# EAGLE schematic Select Fire Rapidstrike (EAGLE 9.4.2)

## Sheet 1 of 3
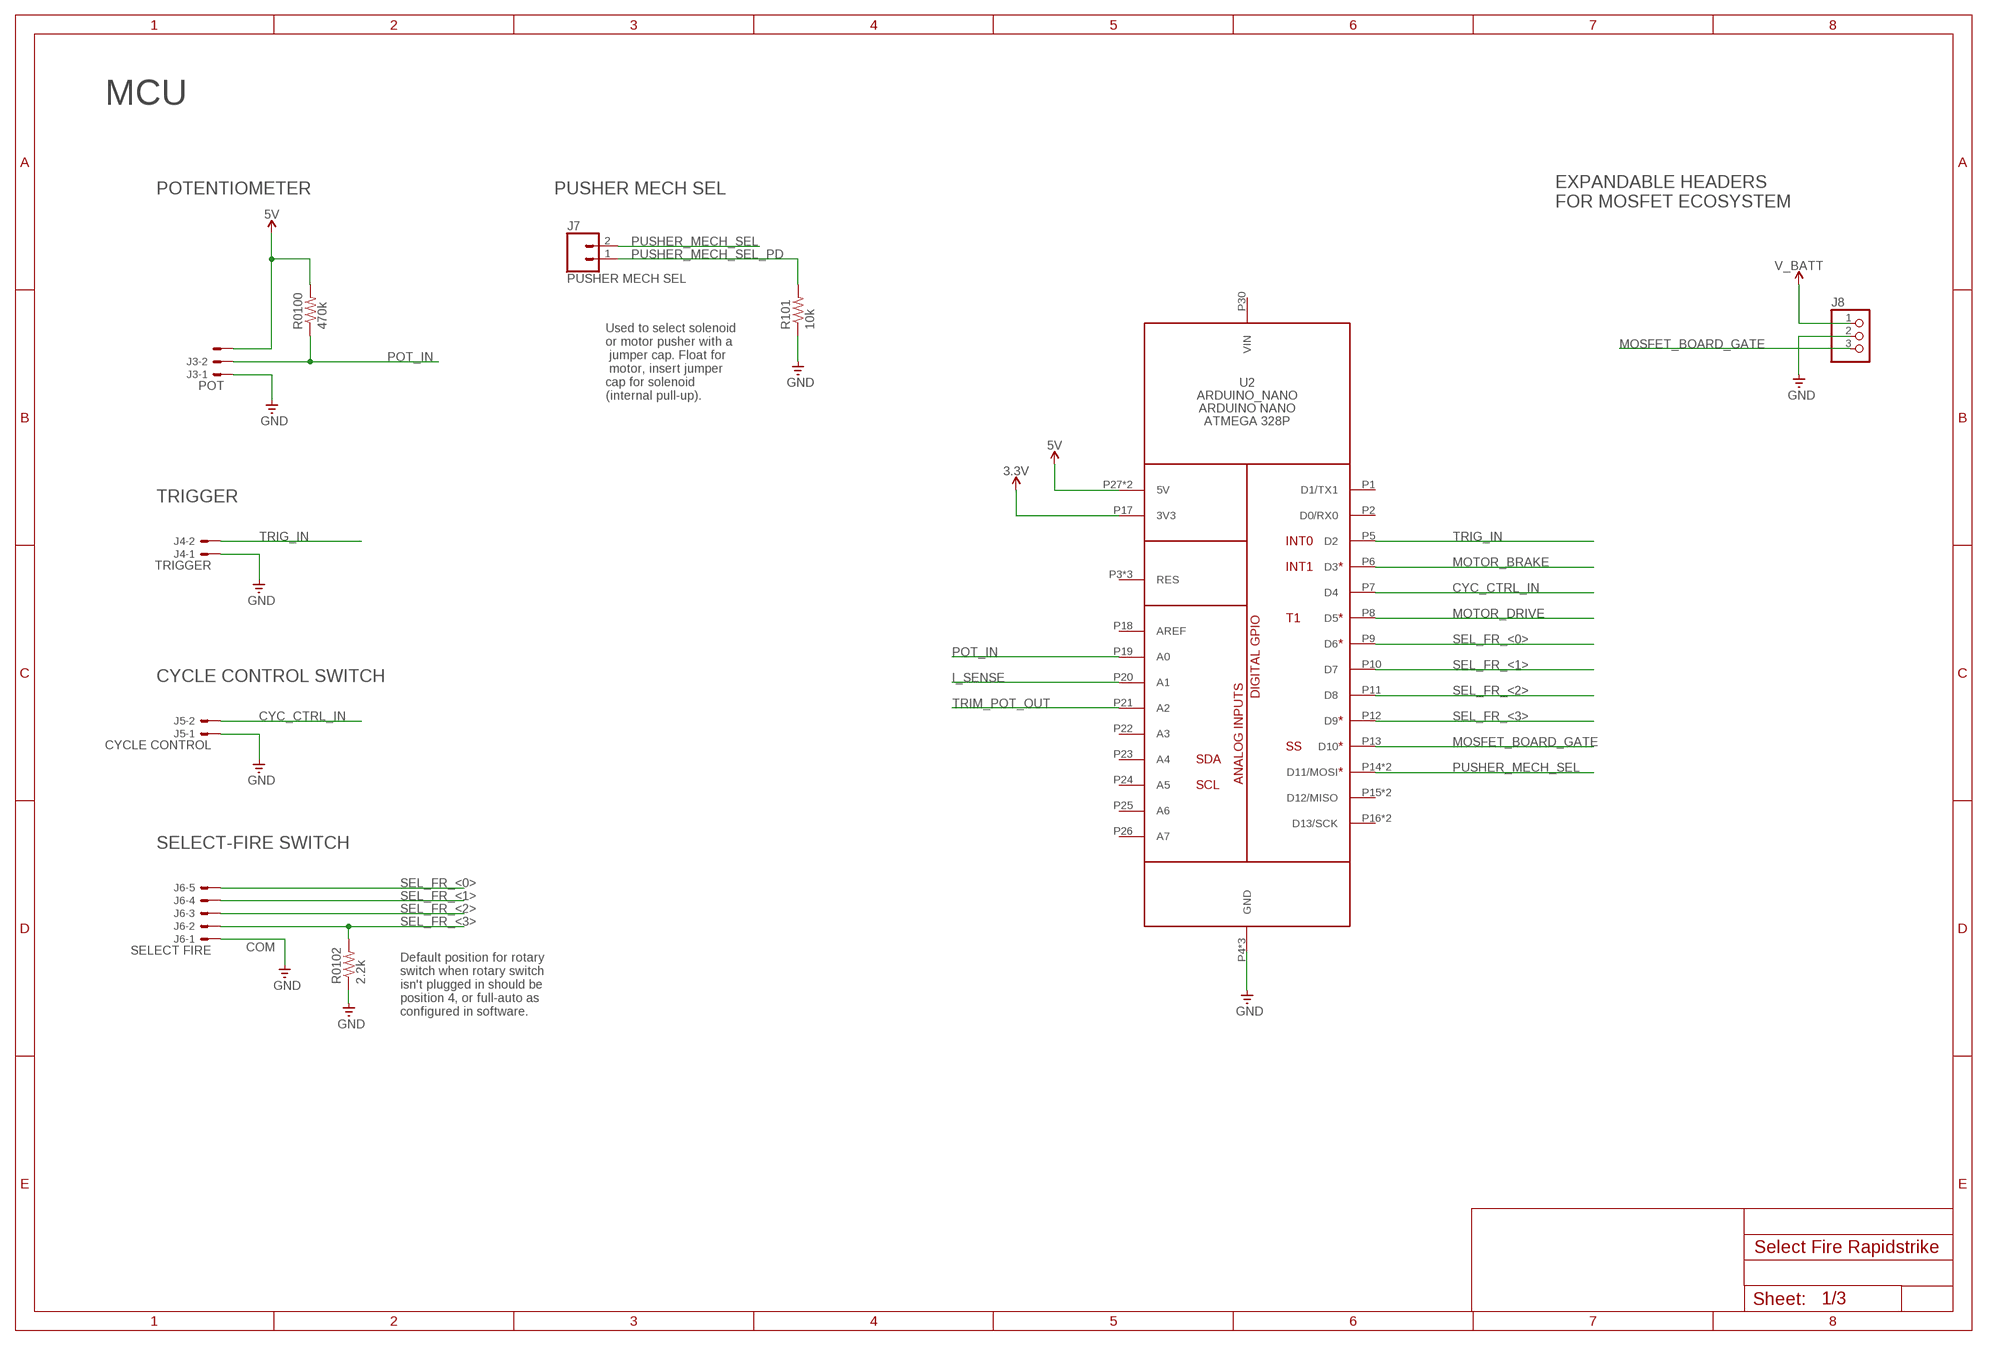
[diagram p0: schematic, sheet 1]

### Parts
J3  POT  JST-XH-03-PIN-LONG-PAD  [JST-XH-03-PACKAGE-LONG-PAD]
J4  TRIGGER  JST-XH-02-PIN-LONG-PAD  [JST-XH-02-PACKAGE-LONG-PAD]
J5  CYCLE CONTROL  JST-XH-02-PIN-LONG-PAD  [JST-XH-02-PACKAGE-LONG-PAD]
J6  SELECT FIRE  JST-XH-05-PIN-LONG-PAD  [JST-XH-05-PACKAGE-LONG-PAD]
J7  PUSHER MECH SEL  CONN_02  [1X02]
J8  PINHD-1X3  [1X03]
R0100  470k  R-US_M0805  [M0805]
R101  10k  R-US_M0805  [M0805]
R0102  2.2k  R-US_M0805  [M0805]
U2  ARDUINO_NANO  [ARDUINO_NANO]

### Nets
3.3V: U2.P17(3V3) ; also sheet 2
5V: J3.3 R0100.2 U2.P27(5V) U2.P36(5V) ; also sheet 2,3
CYC_CTRL_IN: J5.2 U2.P7(D4)
GND: J3.1 J4.1 J5.1 J6.1 J8.2 R101.1 R0102.1 U2.P4(GND) U2.P29(GND) U2.P32(GND) ; also sheet 2,3
I_SENSE: U2.P20(A1) ; also sheet 3
MOSFET_BOARD_GATE: J8.3 U2.P13(D10)
MOTOR_BRAKE: U2.P6(D3) ; also sheet 3
MOTOR_DRIVE: U2.P8(D5) ; also sheet 3
POT_IN: J3.2 R0100.1 U2.P19(A0)
PUSHER_MECH_SEL: J7.2 U2.P14(D11/MOSI) U2.P34(D11/MOSI)
PUSHER_MECH_SEL_PD: J7.1 R101.2
SEL_FR_<0>: J6.5 U2.P9(D6)
SEL_FR_<1>: J6.4 U2.P10(D7)
SEL_FR_<2>: J6.3 U2.P11(D8)
SEL_FR_<3>: J6.2 R0102.2 U2.P12(D9)
TRIG_IN: J4.2 U2.P5(D2)
TRIM_POT_OUT: U2.P21(A2)
V_BATT_RAW: J8.1 ; supply symbol labelled V_BATT ; also sheet 2,3
Unconnected: U2.P1(D1/TX1) U2.P2(D0/RX0) U2.P3(RES) U2.P15(D12/MISO) U2.P16(D13/SCK) U2.P18(AREF) U2.P22(A3) U2.P23(A4) U2.P24(A5) U2.P25(A6) U2.P26(A7) U2.P28(RES) U2.P30(VIN) U2.P31(RES) U2.P33(D13/SCK) U2.P35(D12/MISO)

### Notes on the sheet
- MCU
- POTENTIOMETER | PUSHER MECH SEL
- EXPANDABLE HEADERS 
  FOR MOSFET ECOSYSTEM
- Used to select solenoid 
  or motor pusher with a
   jumper cap. Float for
   motor, insert jumper 
  cap for solenoid 
  (internal pull-up).
- TRIGGER
- CYCLE CONTROL SWITCH
- SELECT-FIRE SWITCH
- COM
- Default position for rotary
  switch when rotary switch 
  isn't plugged in should be 
  position 4, or full-auto as 
  configured in software.

## Sheet 2 of 3
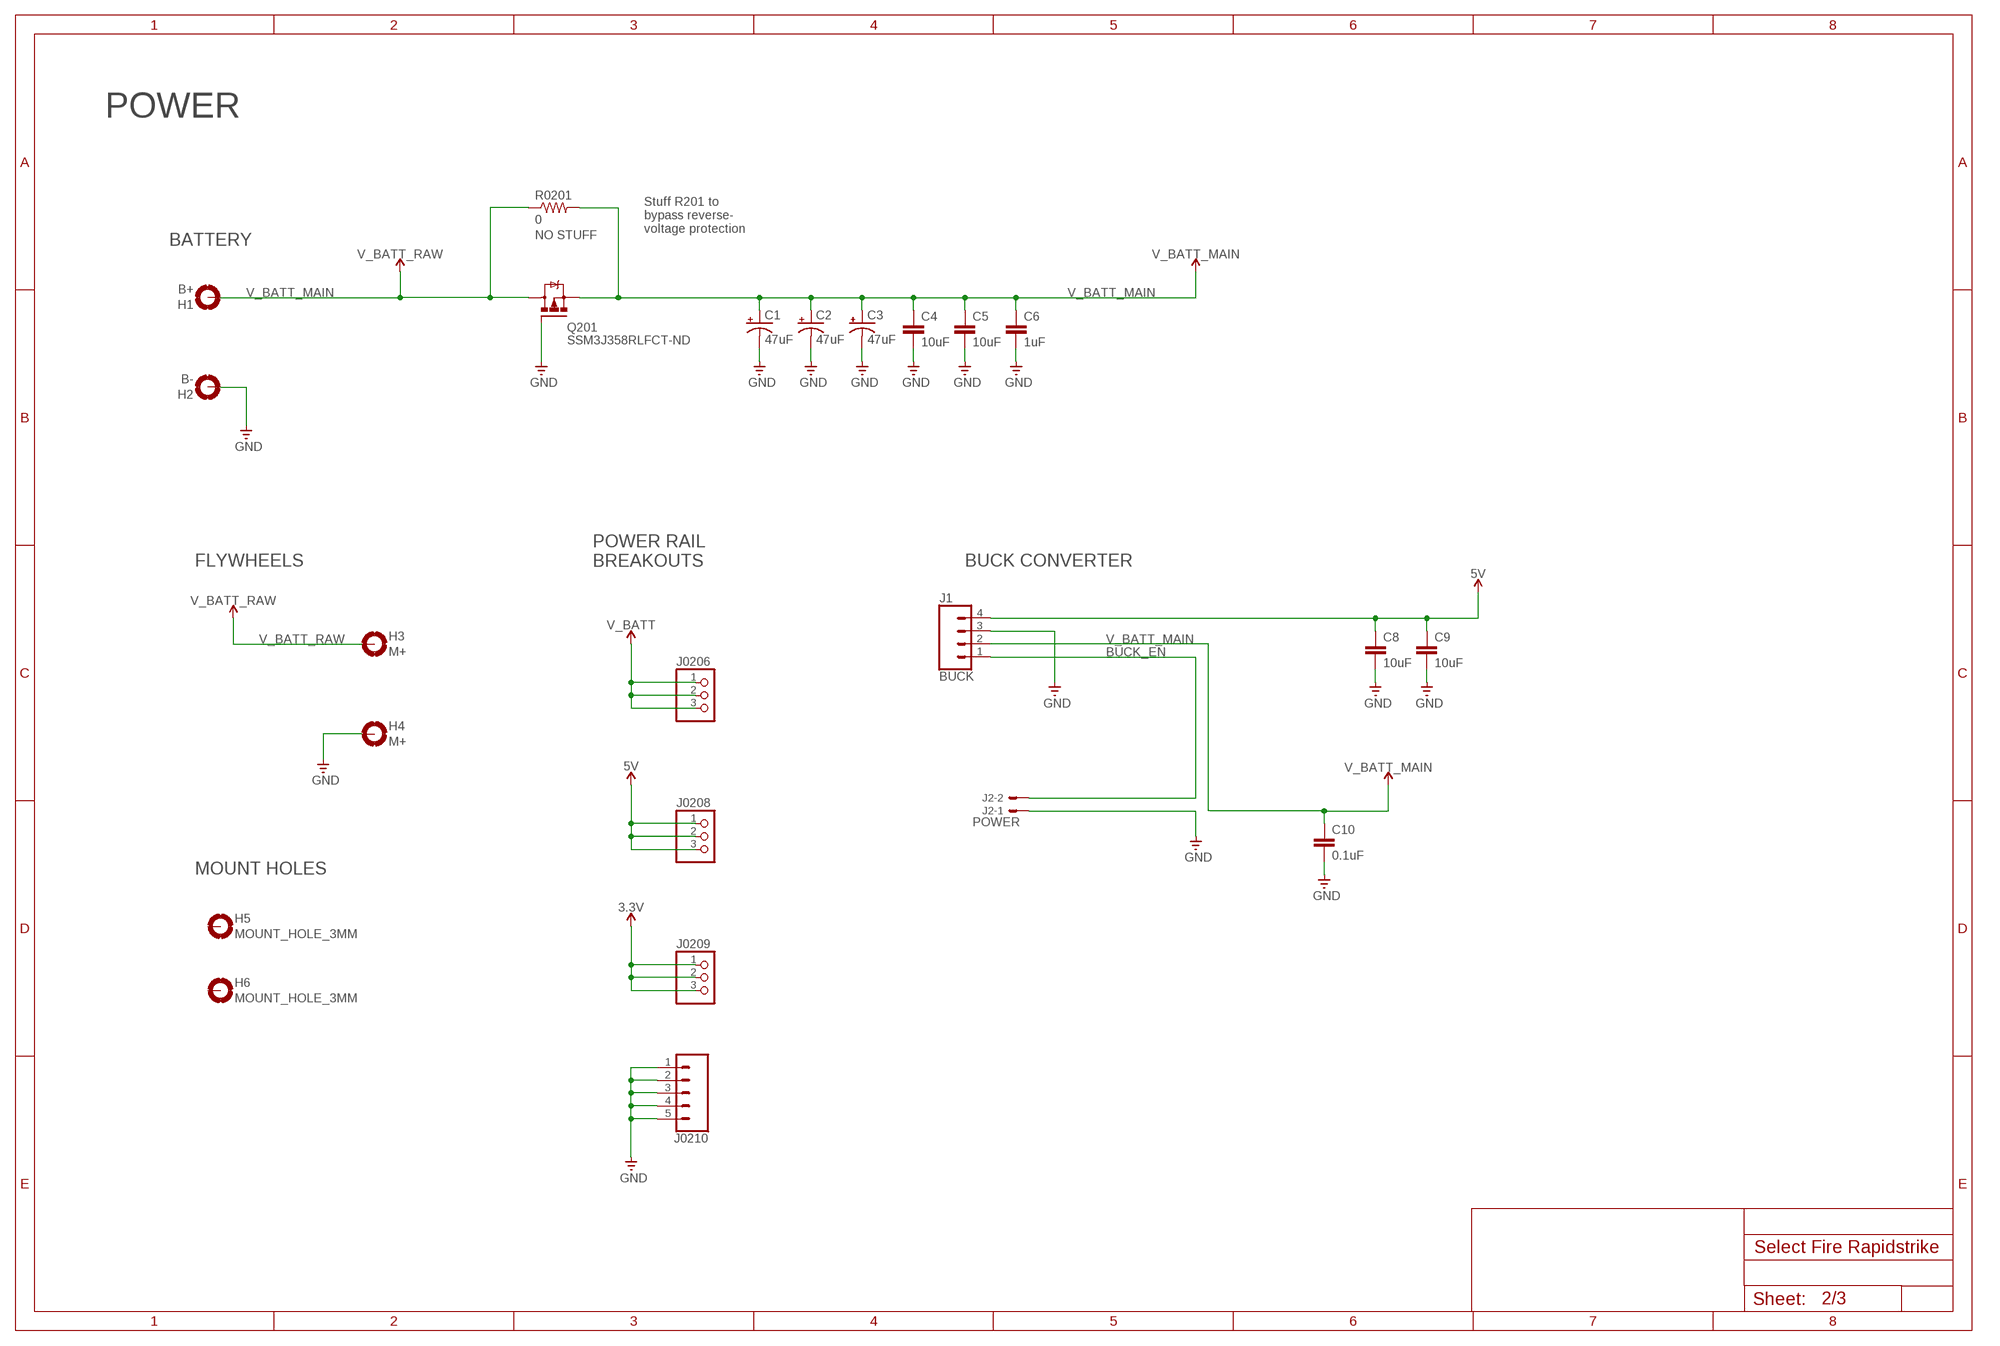
[diagram p1: schematic, sheet 2]

### Parts
C1  47uF  CPOL-USE2-5  [E2-5]
C2  47uF  CPOL-USE2-5  [E2-5]
C3  47uF  CPOL-USE2-5  [E2-5]
C4  10uF  CC1206  [C1206]
C5  10uF  CC1206  [C1206]
C6  1uF  C-EUC0805  [C0805]
C8  10uF  CC1206  [C1206]
C9  10uF  CC1206  [C1206]
C10  0.1uF  C-EUC0805  [C0805]
H1  B+  MOUNT-HOLE-2.5MM  [MOUNT-HOLE-2.5MM]
H2  B-  MOUNT-HOLE-2.5MM  [MOUNT-HOLE-2.5MM]
H3  M+  MOUNT-HOLE-2.5MM  [MOUNT-HOLE-2.5MM]
H4  M+  MOUNT-HOLE-2.5MM  [MOUNT-HOLE-2.5MM]
H5  MOUNT_HOLE_3MM  [MOUNT_HOLE_3MM]
H6  MOUNT_HOLE_3MM  [MOUNT_HOLE_3MM]
J1  BUCK  CONN_04  [1X04]
J2  POWER  JST-XH-02-PIN-LONG-PAD  [JST-XH-02-PACKAGE-LONG-PAD]
J0206  PINHD-1X3  [1X03]
J0208  PINHD-1X3  [1X03]
J0209  PINHD-1X3  [1X03]
J0210  CONN_05  [1X05]
Q201  SSM3J358RLFCT-ND  MOSFET-P-SOT23  [SOT-23]
R0201  0  R-US_R1206  [R1206]

### Nets
3.3V: J0209.1 J0209.2 J0209.3 ; also sheet 1
5V: C8.1 C9.1 J1.4 J0208.1 J0208.2 J0208.3 ; also sheet 1,3
BUCK_EN: J1.1 J2.2
GND: C1.- C2.- C3.- C4.2 C5.2 C6.2 C8.2 C9.2 C10.2 H2.P$1(MOUNT) H4.P$1(MOUNT) J1.3 J2.1 J0210.1 J0210.2 J0210.3 J0210.4 J0210.5 Q201.1(G) ; also sheet 1,3
V_BATT_MAIN: C1.+ C2.+ C3.+ C4.1 C5.1 C6.1 C10.1 J1.2 Q201.2(S) R0201.2 ; supply symbol labelled V_BATT
V_BATT_RAW: H1.P$1(MOUNT) H3.P$1(MOUNT) J0206.1 J0206.2 J0206.3 Q201.3(D) R0201.1 ; supply symbol labelled V_BATT ; also sheet 1,3
Unconnected: H5.P$1(MOUNT) H6.P$1(MOUNT)

### Notes on the sheet
- POWER
- Stuff R201 to 
  bypass reverse-
  voltage protection
- BATTERY
- FLYWHEELS
- POWER RAIL
  BREAKOUTS
- BUCK CONVERTER
- MOUNT HOLES

## Sheet 3 of 3
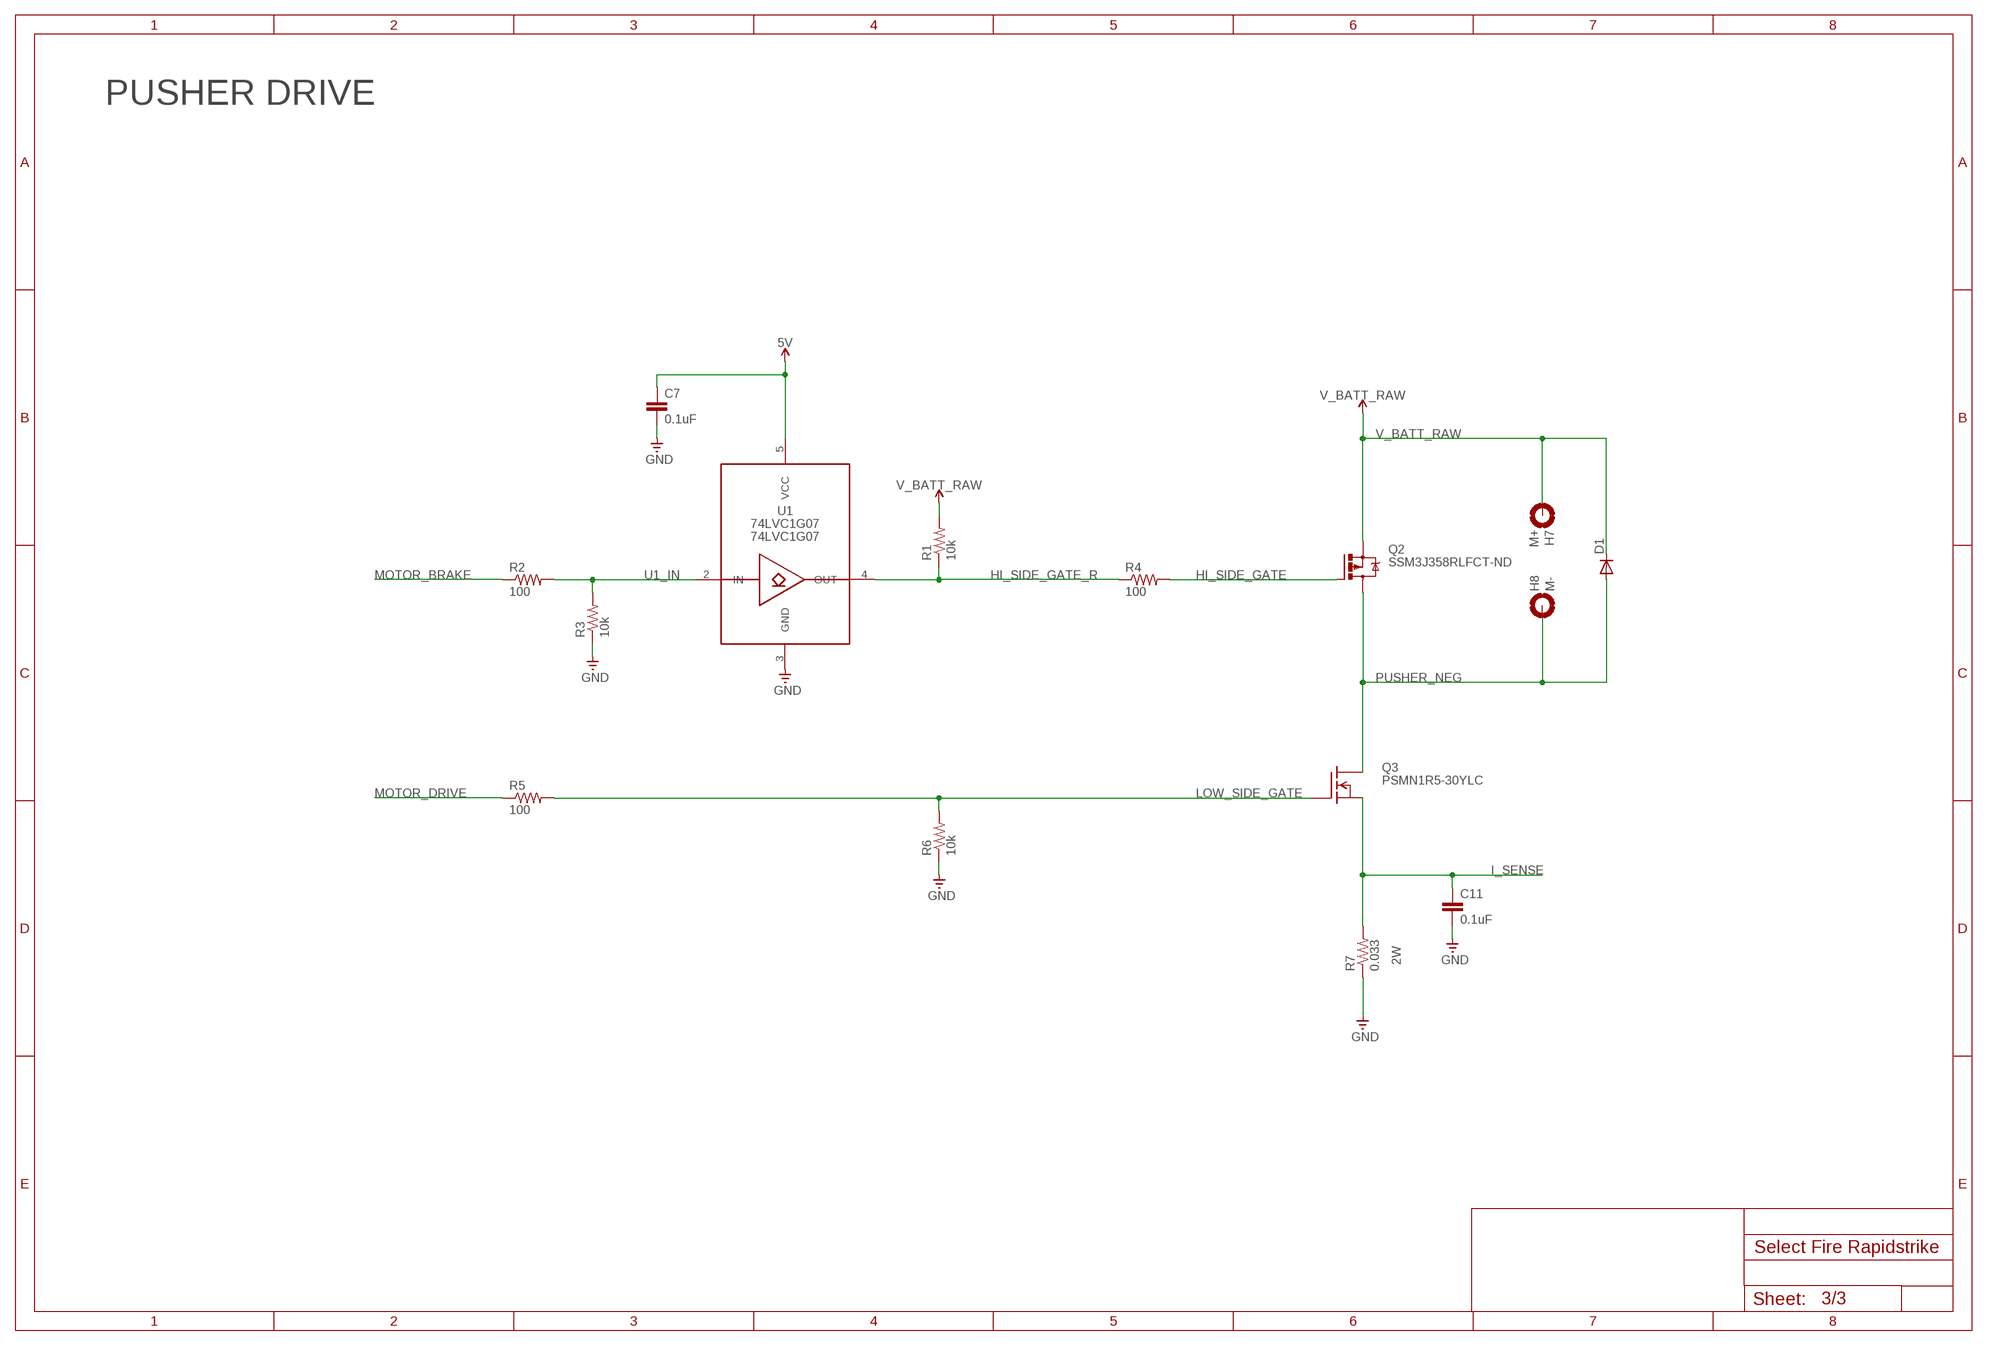
[diagram p2: schematic, sheet 3]

### Parts
C7  0.1uF  C-EUC0805  [C0805]
C11  0.1uF  C-EUC0805  [C0805]
D1  S2A  [DO214AA]
H7  M+  MOUNT-HOLE-2.5MM  [MOUNT-HOLE-2.5MM]
H8  M-  MOUNT-HOLE-2.5MM  [MOUNT-HOLE-2.5MM]
Q2  SSM3J358RLFCT-ND  MOSFET-P-SOT23  [SOT-23]
Q3  PSMN1R5-30YLC  [TO127P600X120-5N]
R1  10k  R-US_M0805  [M0805]
R2  100  R-US_M0805  [M0805]
R3  10k  R-US_M0805  [M0805]
R4  100  R-US_M0805  [M0805]
R5  100  R-US_M0805  [M0805]
R6  10k  R-US_M0805  [M0805]
R7  0.033  R-US_R2512  [R2512]
U1  74LVC1G07  [SOT23-5]

### Nets
5V: C7.1 U1.5(VCC) ; also sheet 1,2
GND: C7.2 C11.2 R3.1 R6.1 R7.1 U1.3(GND) ; also sheet 1,2
HI_SIDE_GATE: Q2.1(G) R4.2
HI_SIDE_GATE_R: R1.1 R4.1 U1.4(OUT)
I_SENSE: C11.1 Q3.1(S) Q3.2(S) Q3.3(S) R7.2 ; also sheet 1
LOW_SIDE_GATE: Q3.4(G) R5.2 R6.2
MOTOR_BRAKE: R2.1 ; also sheet 1
MOTOR_DRIVE: R5.1 ; also sheet 1
PUSHER_NEG: D1.A H8.P$1(MOUNT) Q2.3(D) Q3.5(D)
U1_IN: R2.2 R3.2 U1.2(IN)
V_BATT_RAW: D1.C H7.P$1(MOUNT) Q2.2(S) R1.2 ; supply symbol labelled V_BATT ; also sheet 1,2

### Notes on the sheet
- PUSHER DRIVE

## Library data of the parts
C1-C3 = adafruit:CPOL-US: POLARIZED CAPACITOR, American symbol
C4 C5 C8 C9 = eagle-ltspice:C: CAPACITOR, European symbol; SPICEMODEL: NONE; SPICEPREFIX: C
C6 C7 C10 C11 = rcl:C-EU: CAPACITOR, European symbol; SPICEPREFIX: C
D1 = s2x_10:S2*: S2A - S2M General Purpose Rectifiers Source: http://www.fairchildsemi.com/datasheets/S2/S2A.pdf; MF: Fairchild; MPN: S2A; OC_FARNELL: 1467485; OC_NEWARK: 58K2391
H1-H4 H7 H8 = my-eagle-lib:MOUNT-HOLE-2.5MM: Mount hole, 2.5mm inner diameter. Fits 14awg wiring great, 16awg a bit tight. Used in MOSFET board kit v1.2.
H5 H6 = my-eagle-lib:MOUNT_HOLE_3MM: Mount hole with 3mm inner diameter. Should be good for Nerf screws, will test that in Select-fire Rapidstrik p0.1 board MLB.
J1 = SparkFun-Connectors:CONN_04: Multi connection point. Often used as Generic Header-pin footprint for 0.1 inch spaced/style header connections On any of the 0.1 inch spaced packages, you can populate with these: Break Away Headers - Straight <https://www.sparkfun.com/products/116> (PRT-00116) Break Away Male Headers - Right Angle <https://www.sparkfun.com/products/553> (PRT-00553) Female Headers <https://www.sparkfun.com/products/115> (PRT-00115) Break Away Headers - Machine Pin <https://www.sparkfun.com/products/117> (PRT-00117) Break Away Female Headers - Swiss Machine Pin <https://www.sparkfun.com/products/743> (PRT-00743) For SCREWTERMINALS and SPRING TERMINALS visit here: Screw Terimnals on SparkFun.com <https://www.sparkfun.com/search/results?term=Screw+Terminals> (5mm/3.5mm/2.54mm spacing) This device is also useful as a general connection point to wire up your design to another part of your project. Our various solder wires solder well into these plated through hole pads. Hook-Up Wire - Assortment (Stranded, 22 AWG) <https://www.sparkfun.com/products/11375> (PRT-11375) Hook-Up Wire - Assortment (Solid Core, 22 AWG) <https://www.sparkfun.com/products/11367> (PRT-11367) View the entire wire category on our website here <https://www.sparkfun.com/categories/141> Special notes: Molex polarized connector foot print use with SKU : PRT-08231 with associated crimp pins and housings. 1MM SMD Version SKU: PRT-10208; PROD_ID: CONN-09696
J2 J4 J5 = Rembrandt Electronics - JST XH Connectors v1-0:JST-XH-02-PIN: JST XH Connector 2 Pin Wire to board connector. Pitch: 2,54 mm, (0.100") Number of pins: 2 Created by Rembrandt Electronics www.rembrandtelectronics.com
J3 = Rembrandt Electronics - JST XH Connectors v1-0:JST-XH-03-PIN: JST XH Connector 2 Pin Wire to board connector. Pitch: 2,54 mm, (0.100") Number of pins: 3 Created by Rembrandt Electronics www.rembrandtelectronics.com
J6 = Rembrandt Electronics - JST XH Connectors v1-0:JST-XH-05-PIN: JST XH Connector 2 Pin Wire to board connector. Pitch: 2,54 mm, (0.100") Number of pins: 5 Created by Rembrandt Electronics www.rembrandtelectronics.com
J7 = SparkFun-Connectors:CONN_02: Multi connection point. Often used as Generic Header-pin footprint for 0.1 inch spaced/style header connections On any of the 0.1 inch spaced packages, you can populate with these: Break Away Headers - Straight <https://www.sparkfun.com/products/116> (PRT-00116) Break Away Male Headers - Right Angle <https://www.sparkfun.com/products/553> (PRT-00553) Female Headers <https://www.sparkfun.com/products/115> (PRT-00115) Break Away Headers - Machine Pin <https://www.sparkfun.com/products/117> (PRT-00117) Break Away Female Headers - Swiss Machine Pin <https://www.sparkfun.com/products/743> (PRT-00743) For SCREWTERMINALS and SPRING TERMINALS visit here: Screw Terimnals on SparkFun.com <https://www.sparkfun.com/search/results?term=Screw+Terminals> (5mm/3.5mm/2.54mm spacing) This device is also useful as a general connection point to wire up your design to another part of your project. Our various solder wires solder well into these plated through hole pads. Hook-Up Wire - Assortment (Stranded, 22 AWG) <https://www.sparkfun.com/products/11375> (PRT-11375) Hook-Up Wire - Assortment (Solid Core, 22 AWG) <https://www.sparkfun.com/products/11367> (PRT-11367) View the entire wire category on our website here <https://www.sparkfun.com/categories/141> Special notes: Molex polarized connector foot print use with: PRT-08233 with associated crimp pins and housings. 2.54_SCREWTERM for use with PRT-10571. 3.5mm Screw Terminal footprints for PRT-08084 5mm Screw Terminal footprints for use with PRT-08432
J8 J0206 J0208 J0209 = adafruit:PINHD-1X3: PIN HEADER
J0210 = SparkFun-Connectors:CONN_05: Multi connection point. Often used as Generic Header-pin footprint for 0.1 inch spaced/style header connections On any of the 0.1 inch spaced packages, you can populate with these: Break Away Headers - Straight <https://www.sparkfun.com/products/116> (PRT-00116) Break Away Male Headers - Right Angle <https://www.sparkfun.com/products/553> (PRT-00553) Female Headers <https://www.sparkfun.com/products/115> (PRT-00115) Break Away Headers - Machine Pin <https://www.sparkfun.com/products/117> (PRT-00117) Break Away Female Headers - Swiss Machine Pin <https://www.sparkfun.com/products/743> (PRT-00743) For SCREWTERMINALS and SPRING TERMINALS visit here: Screw Terimnals on SparkFun.com <https://www.sparkfun.com/search/results?term=Screw+Terminals> (5mm/3.5mm/2.54mm spacing) This device is also useful as a general connection point to wire up your design to another part of your project. Our various solder wires solder well into these plated through hole pads. Hook-Up Wire - Assortment (Stranded, 22 AWG) <https://www.sparkfun.com/products/11375> (PRT-11375) Hook-Up Wire - Assortment (Solid Core, 22 AWG) <https://www.sparkfun.com/products/11367> (PRT-11367) View the entire wire category on our website here <https://www.sparkfun.com/categories/141> Special notes: Molex polarized connector foot print use with SKU : PRT-08231 with associated crimp pins and housings. 1MM SMD Version SKU: PRT-10208
Q2 Q201 = bt_transistor:MOSFET-P: P-Channel MOSFET with integrated body diode
Q3 = my-eagle-lib:PSMN1R5-30YLC: PSMN1R5-30YLC N-Channel Power MOSFET 30V, 100A, 1.55mΩ logic level MOSFET, surface-mount SOT669 package Datasheet <https://assets.nexperia.com/documents/data-sheet/PSMN1R5-30YLC.pdf> DigiKey Buy Link <https://www.digikey.com/product-detail/en/nexperia-usa-inc/PSMN1R5-30YLC115/1727-5297-1-ND/2674291> Package stolen from here <https://www.mikrocontroller.net/topic/236049> Symbol stolen from here <https://github.com/adafruit/Adafruit-Eagle-Library>
R1-R6 R0100 R101 R0102 = adafruit:R-US_: RESISTOR, American symbol
R7 = adafruit:R-US_: RESISTOR, American symbol; POWER: 2W
R0201 = adafruit:R-US_: RESISTOR, American symbol; STUFF: NO STUFF
U1 = my-eagle-lib:74LVC1G07: The 74LVC1G07 is a single buffer gate with an open-drain output. The device is designed for operation with a power supply range of 1.65V to 5.5V. The input is tolerant to 5.5V allowing this device to be used in a mixed voltage environment. The device is fully specified for partial power down applications using IOFF. The IOFF circuitry disables the output preventing damaging current backflow when the device is powered down. The open-drain output can be connected to other open drain outputs to implement active-low wired-OR or active-high wired-AND functions. The maximum sink current is 32mA. https://www.diodes.com/assets/Datasheets/74LVC1G07.pdf
U2 = my-eagle-lib:ARDUINO_NANO